# Altium schematic sheet BRD9057A_SiWx917M_4-Layer_ExtSw_REF_DES_A01_Page_4.SchDoc: =TitlePage4
size A3; Organization: Altium Limited; Address1: L3, 12a Rodborough Rd; Address2: Frenchs Forest; Address3: NSW; Address4: Australia 2086; SheetNumber: 4; SheetTotal: 5
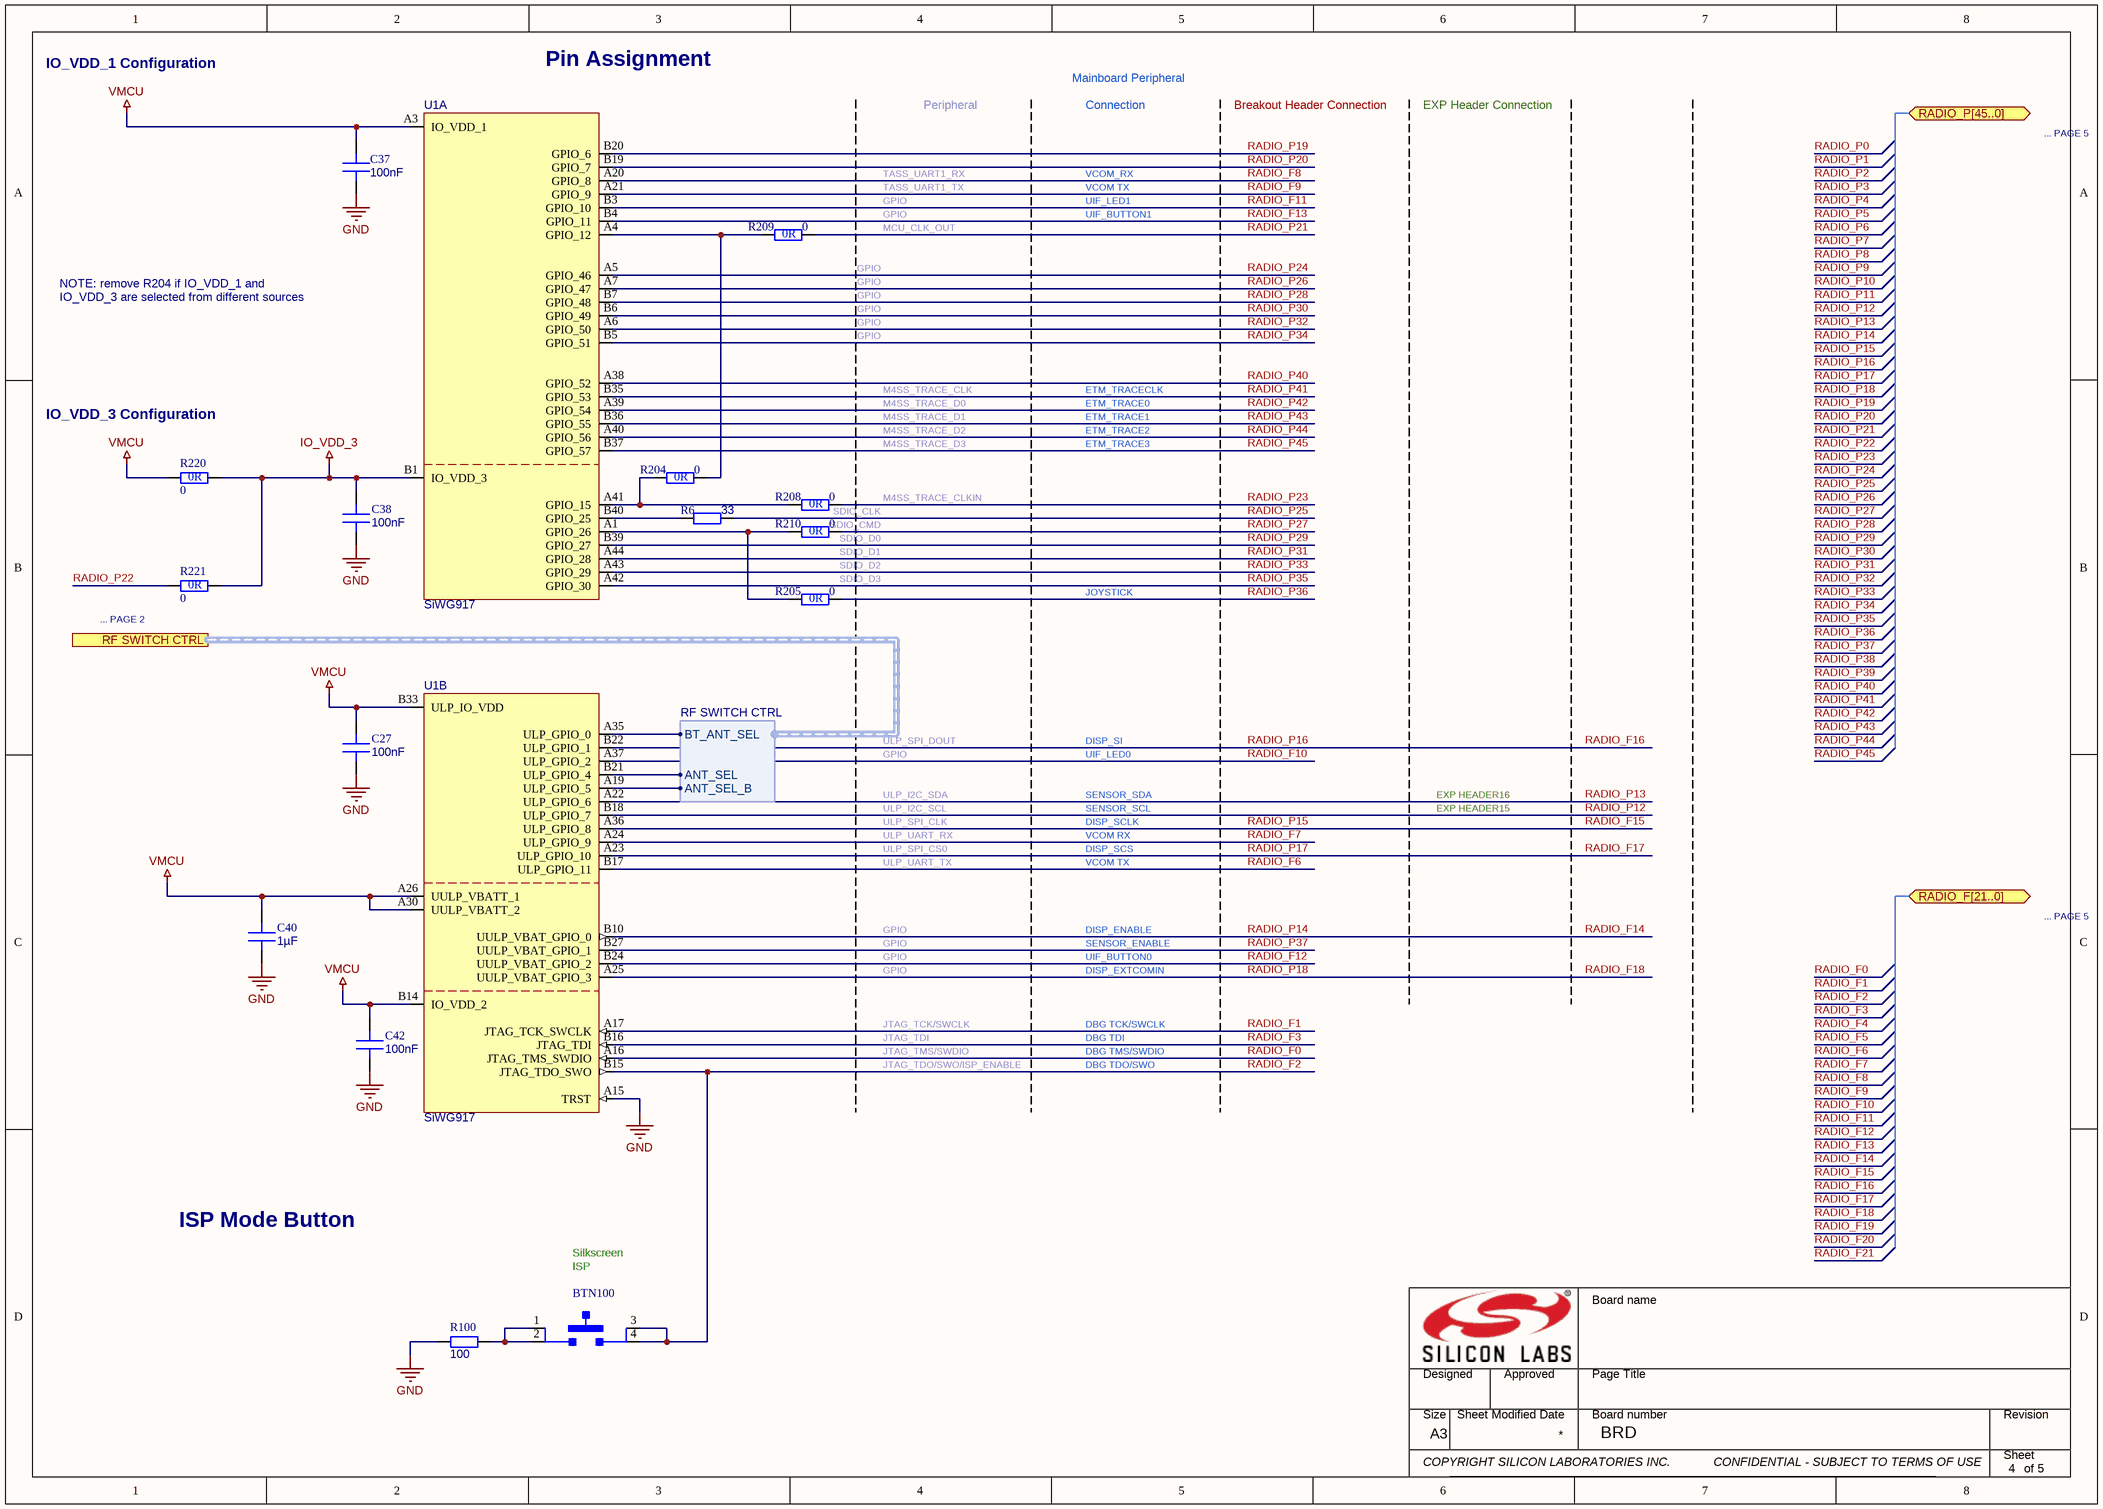
[diagram p0: BRD9057A_SiWx917M_4-Layer_ExtSw_REF_DES_A01_Page_4.SchDoc]

## Parts
BTN100  PTS810 SJM 250 SMTR LFS  [SW_PTS810SJM250SMTRLFS]  (value not drawn)
C27  value 100nF  [C0201_GM]  (hidden comment: CAP CER 0201 X5R 100nF 16V 10%)
C37  value 100nF  [C0201_GM]  (hidden comment: CAP CER 0201 X5R 100nF 16V 10%)
C38  value 100nF  [C0201_GM]  (hidden comment: CAP CER 0201 X5R 100nF 16V 10%)
C40  value 1µF  [C0201_GM]  (hidden comment: CAP CER 0201 X5R 1uF 16V 20%)
C42  value 100nF  [C0201_GM]  (hidden comment: CAP CER 0201 X5R 100nF 16V 10%)
R6  value 33  [R0201]  (hidden comment: RES 0201 33R 1/20W 1% 200ppm)
R100  value 100  [R0201]  (hidden comment: RES 0201 100R 1/20W 1% 200ppm)
R204  value 0  [R0402]  (hidden comment: RES 0402 0R)
R205  value 0  [R0402]  (hidden comment: RES 0402 0R)  (no BOM)
R208  value 0  [R0402]  (hidden comment: RES 0402 0R)  (no BOM)
R209  value 0  [R0402]  (hidden comment: RES 0402 0R)  (no BOM)
R210  value 0  [R0402]  (hidden comment: RES 0402 0R)
R220  value 0  [R0402]  (hidden comment: RES 0402 0R)
R221  value 0  [R0402]  (hidden comment: RES 0402 0R)  (no BOM)
U1  value SiWG917  [QFN84_SI_SiWx917_A1]  (hidden comment: SiWG917M111MGTBAR)  (parts A,B of 4)

## Ports
RADIO_F[21..0] (bidir), RADIO_P[45..0] (bidir), RF SWITCH CTRL (harness RF SWITCH CTRL)

## Harnesses
RF SWITCH CTRL: BT_ANT_SEL, ANT_SEL_B, ANT_SEL

## Nets
GND: C27.1 C37.1 C38.1 C40.1 C42.1 R100.2 U1.A15(TRST)
IO_VDD_3: C38.2 R220.2 R221.2 U1.B1(IO_VDD_3)
VMCU: C27.2 C37.2 C40.2 C42.2 R220.1 U1.A3(IO_VDD_1) U1.A26(UULP_VBATT_1) U1.A30(UULP_VBATT_2) U1.B14(IO_VDD_2) U1.B33(ULP_IO_VDD)
RADIO_F0: U1.A16(JTAG_TMS_SWDIO)
RADIO_F1: U1.A17(JTAG_TCK_SWCLK)
RADIO_F2: BTN100.3 BTN100.4 U1.B15(JTAG_TDO_SWO)
RADIO_F3: U1.B16(JTAG_TDI)
RADIO_F6: U1.B17(ULP_GPIO_11)
RADIO_F7: U1.A24(ULP_GPIO_9)
RADIO_F8: U1.A20(GPIO_8)
RADIO_F9: U1.A21(GPIO_9)
RADIO_F10: U1.A37(ULP_GPIO_2)
RADIO_F11: U1.B3(GPIO_10)
RADIO_F12: U1.B24(UULP_VBAT_GPIO_2)
RADIO_F13: U1.B4(GPIO_11)
RADIO_F14: U1.B10(UULP_VBAT_GPIO_0)  [also labelled RADIO_P14]
RADIO_F15: U1.A36(ULP_GPIO_8)  [also labelled RADIO_P15]
RADIO_F16: U1.B22(ULP_GPIO_1)  [also labelled RADIO_P16]
RADIO_F17: U1.A23(ULP_GPIO_10)  [also labelled RADIO_P17]
RADIO_F18: U1.A25(UULP_VBAT_GPIO_3)  [also labelled RADIO_P18]
RADIO_P12: U1.B18(ULP_GPIO_7)
RADIO_P13: U1.A22(ULP_GPIO_6)
RADIO_P19: U1.B20(GPIO_6)
RADIO_P20: U1.B19(GPIO_7)
RADIO_P21: R209.2
RADIO_P22: R221.1
RADIO_P23: R208.2
RADIO_P24: U1.A5(GPIO_46)
RADIO_P25: R6.2
RADIO_P26: U1.A7(GPIO_47)
RADIO_P27: R210.2
RADIO_P28: U1.B7(GPIO_48)
RADIO_P29: U1.B39(GPIO_27)
RADIO_P30: U1.B6(GPIO_49)
RADIO_P31: U1.A44(GPIO_28)
RADIO_P32: U1.A6(GPIO_50)
RADIO_P33: U1.A43(GPIO_29)
RADIO_P34: U1.B5(GPIO_51)
RADIO_P35: U1.A42(GPIO_30)
RADIO_P36: R205.2
RADIO_P37: U1.B27(UULP_VBAT_GPIO_1)
RADIO_P40: U1.A38(GPIO_52)
RADIO_P41: U1.B35(GPIO_53)
RADIO_P42: U1.A39(GPIO_54)
RADIO_P43: U1.B36(GPIO_55)
RADIO_P44: U1.A40(GPIO_56)
RADIO_P45: U1.B37(GPIO_57)
NetBTN100_1: BTN100.1 BTN100.2 R100.1
NetR6_1: R6.1 U1.B40(GPIO_25)
NetR204_1: R204.1 R208.1 U1.A41(GPIO_15)
NetR204_2: R204.2 R209.1 U1.A4(GPIO_12)
NetR205_1: R205.1 R210.1 U1.A1(GPIO_26)
NetU1_A19: U1.A19(ULP_GPIO_5) ; port RF SWITCH CTRL.ANT_SEL_B
NetU1_A35: U1.A35(ULP_GPIO_0) ; port RF SWITCH CTRL.BT_ANT_SEL
NetU1_B21: U1.B21(ULP_GPIO_4) ; port RF SWITCH CTRL.ANT_SEL

## Notes on the sheet
- IO_VDD_1 Configuration
- Pin Assignment
- Peripheral
- Mainboard Peripheral
- Connection
- Breakout Header Connection
- EXP Header Connection
- TASS_UART1_RX
- VCOM_RX
- ... PAGE 5
- TASS_UART1_TX
- MCU_CLK_OUT
- GPIO
- VCOM TX
- UIF_BUTTON1
- UIF_LED1
- NOTE: remove R204 if IO_VDD_1 and IO_VDD_3 are selected from different sources
- IO_VDD_3 Configuration
- M4SS_TRACE_D0
- M4SS_TRACE_CLK
- M4SS_TRACE_D1
- M4SS_TRACE_D2
- M4SS_TRACE_D3
- ETM_TRACECLK
- ETM_TRACE0
- ETM_TRACE1
- ETM_TRACE2
- ETM_TRACE3
- SDIO_CLK
- M4SS_TRACE_CLKIN
- SDIO_CMD
- SDIO_D0
- SDIO_D1
- SDIO_D2
- SDIO_D3
- ... PAGE 2
- JOYSTICK
- ULP_SPI_DOUT
- UIF_LED0
- DISP_SI
- ULP_I2C_SCL
- ULP_I2C_SDA
- ULP_SPI_CLK
- ULP_UART_RX
- ULP_SPI_CS0
- VCOM RX
- DISP_SCS
- DISP_SCLK
- SENSOR_SCL
- SENSOR_SDA
- EXP HEADER15
- EXP HEADER16
- ULP_UART_TX
- UIF_BUTTON0
- DISP_EXTCOMIN
- DISP_ENABLE
- SENSOR_ENABLE
- JTAG_TCK/SWCLK
- JTAG_TMS/SWDIO
- JTAG_TDI
- DBG TCK/SWCLK
- DBG TMS/SWDIO
- DBG TDI
- JTAG_TDO/SWO/ISP_ENABLE
- DBG TDO/SWO
- ISP Mode Button
- Silkscreen
- ISP
- Board name
- Designed
- Approved
- Page Title
- Size
- A3
- Sheet Modified Date
- Board number
- BRD
- Revision
- Sheet
- COPYRIGHT SILICON LABORATORIES INC.
- CONFIDENTIAL - SUBJECT TO TERMS OF USE
- of
- (in symbol CMP-180-00061-B.02) 0R

## Library data of the parts
BTN100 = CMP-185-00008-A.03: Tactile Switch SPST-NO 0.05A 16V; Manufacturer: C&K; Max Operating Temp: 85°C; Value: PTS810; Manufacturer PN: PTS810 SJM 250 SMTR LFS; Mount: SMD; Min Operating Temp: -40°C; RoHS: Compliant; Package: 4.2mm X 3.2mm; SubCategory Tag: Tactile
C27 C37 C38 C42 = CMP-120-00007-B.06: SubCategory Tag: Ceramic; RoHS: Compliant; Material: X5R; Max Operating Temp: 85°C; Min Operating Temp: -55°C; Rating: 16V; Package: 0201; Mount: SMD; Tolerance: 10%
C40 = CMP-120-00154-A.04: SubCategory Tag: Ceramic; RoHS: Compliant; Material: X5R; Max Operating Temp: 85°C; Min Operating Temp: -55°C; Rating: 16V; Package: 0201; Mount: SMD; Tolerance: 20%
R6 = CMP-180-00277-A.01: Rating: 50mW; SubCategory Tag: Thick Film; Mount: SMD; Tolerance: 1%; RoHS: Compliant; Min Operating Temp: -55°C; Package: 0201; Max Operating Temp: 155°C
R100 = CMP-180-00121-A.01: Rating: 50mW; SubCategory Tag: Thick Film; Package: 0201; Min Operating Temp: -55°C; Max Operating Temp: 155°C; Tolerance: 1%; RoHS: Compliant; Mount: SMD
R204 R205 R208-R210 R220 R221 = CMP-180-00061-B.02: Rating: 62.5mW; SubCategory Tag: Thick Film; Tolerance: 0%; Min Operating Temp: -55°C; Max Operating Temp: 155°C; RoHS: Compliant; Package: 0402; Mount: SMD
U1 = CMP-150-00167-C.02: IC SoC 32BIT 8MB FLASH QFN84 2.4GHz Single Band Wi-Fi; Manufacturer: Silicon Labs; Additional Search Tag: SoC Wireless; SubCategory Tag: Embedded; Voltage: 3.63V; Min Operating Temp: -40°C; Max Operating Temp: 85°C; Manufacturer PN: SiWG917M111MGTBAR; RoHS: Compliant; Mount: SMD; Package: QFN84